# EAGLE design Solenoid_Board (EAGLE 6.2)
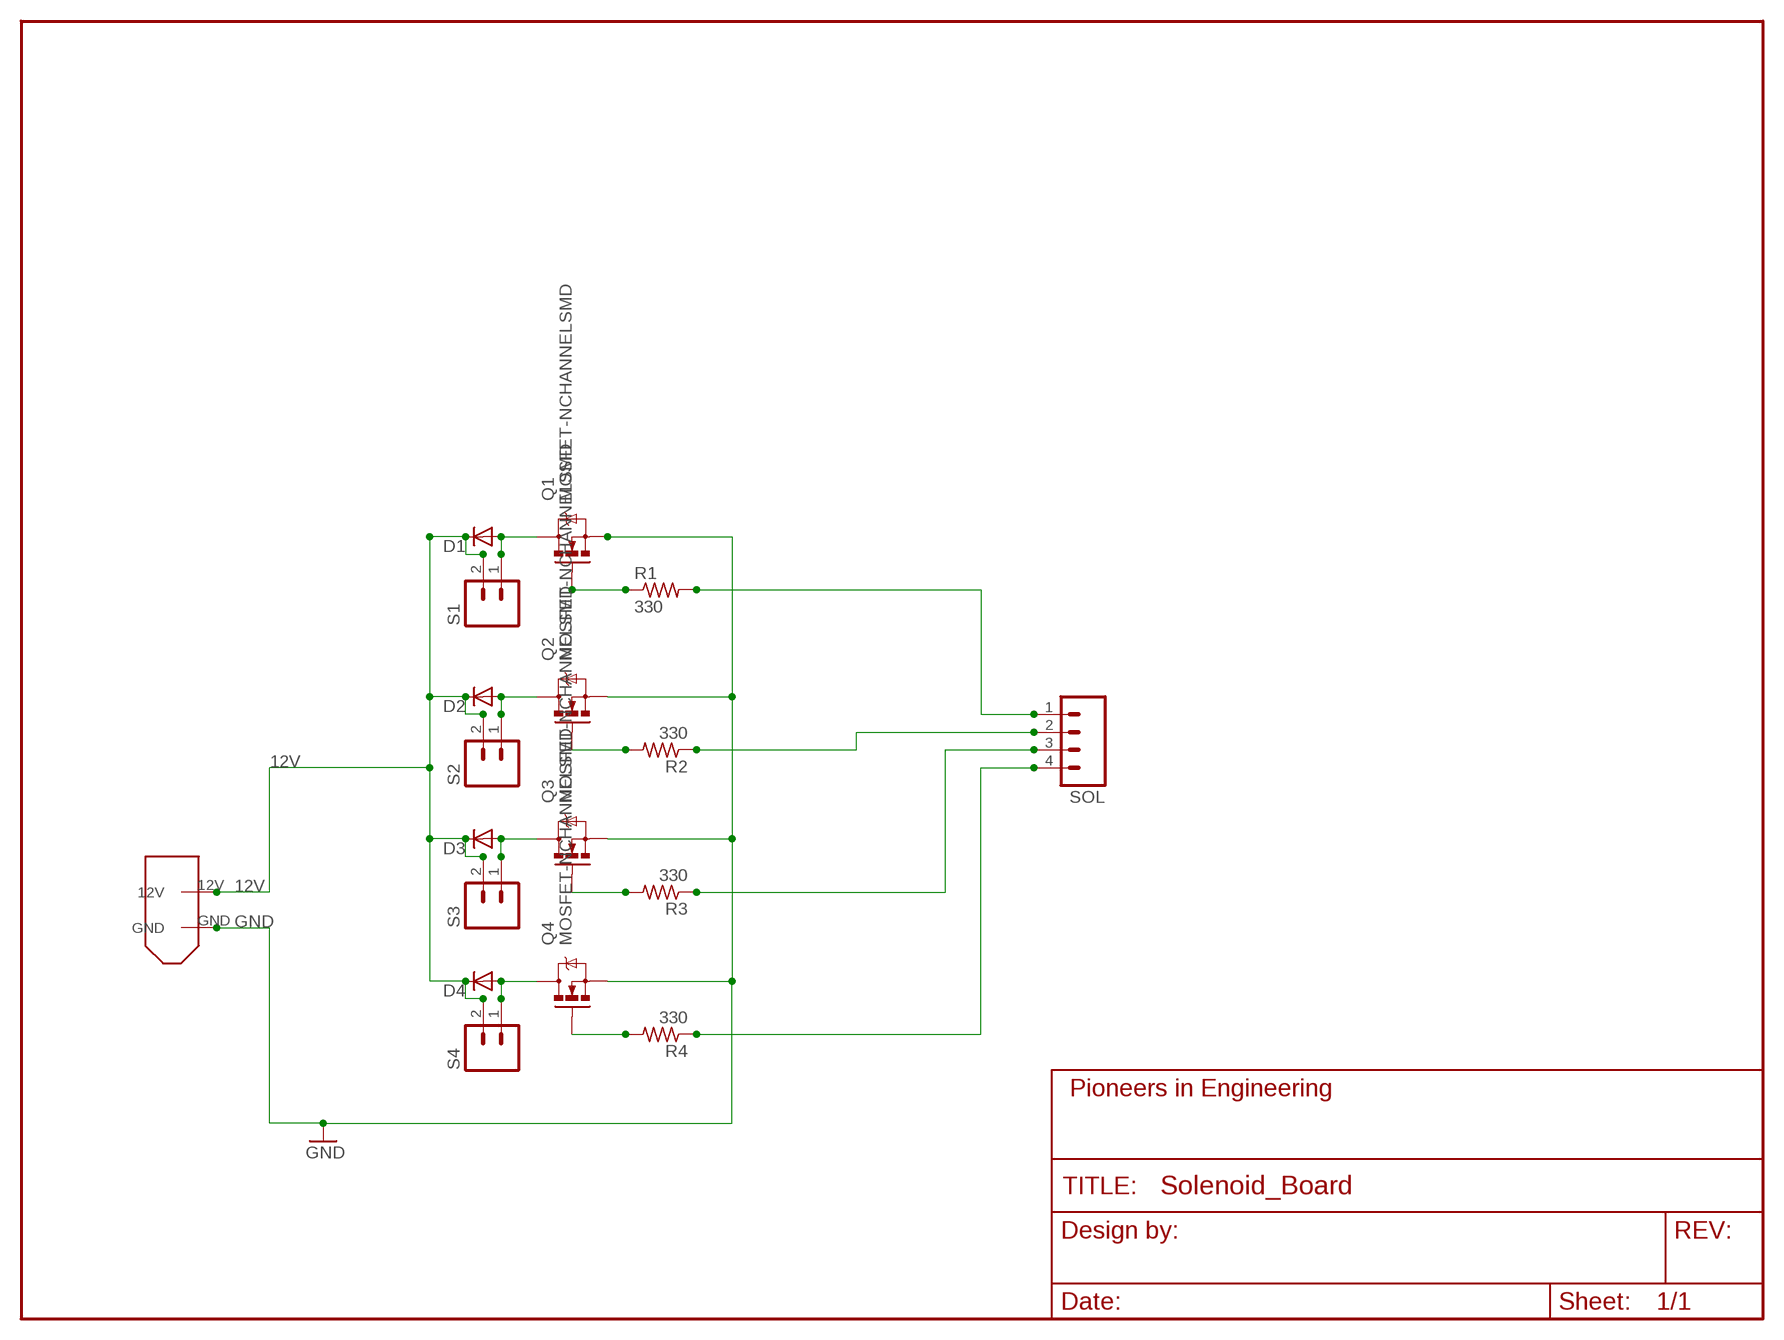
[diagram p0: schematic, sheet 1]
FRAME1 (FRAME-LETTER): AUTHOR: Sumita Ghosh; REVISION: B

## Parts
D1  DIODESMA-ALT  [SMA-DIODE_ALT]
D2  DIODESMA-ALT  [SMA-DIODE_ALT]
D3  DIODESMA-ALT  [SMA-DIODE_ALT]
D4  DIODESMA-ALT  [SMA-DIODE_ALT]
Q1  MOSFET-NCHANNELSMD  [SOT23-3]
Q2  MOSFET-NCHANNELSMD  [SOT23-3]
Q3  MOSFET-NCHANNELSMD  [SOT23-3]
Q4  MOSFET-NCHANNELSMD  [SOT23-3]
R1  330  R-US_R0603  [R0603]
R2  330  R-US_R0603  [R0603]
R3  330  R-US_R0603  [R0603]
R4  330  R-US_R0603  [R0603]
S1  M02  [1X02]
S2  M02  [1X02]
S3  M02  [1X02]
S4  M02  [1X02]
SOL  M04  [1X04]
U$2  XT60CONNECTOR  [XT60CONNECTOR]

## Nets
12V [power]: D1.C D2.C D3.C D4.C S1.2 S2.2 S3.2 S4.2 U$2.12V
GND: Q1.2(S) Q2.2(S) Q3.2(S) Q4.2(S) U$2.GND
N$1: R1.2 SOL.1
N$2: D1.A Q1.3(D) S1.1
N$3 [power]: D4.A Q4.3(D) S4.1
N$4 [power]: D3.A Q3.3(D) S3.1
N$5: R2.1 SOL.2
N$6: R3.1 SOL.3
N$7: R4.1 SOL.4
N$8 [power]: D2.A Q2.3(D) S2.1
N$15: Q1.1(G) R1.1
N$16: Q2.1(G) R2.2
N$17: Q3.1(G) R3.2
N$18: Q4.1(G) R4.2

## Library data of the parts
D1-D4 = SparkFun:DIODE: Diode These are standard reverse protection diodes and small signal diodes. SMA package can handle up to about 1A. SOD-323 can handle about 200mA. What the SOD-323 package when ordering, there are some mfgs out there that are 5-pin packages.
Q1-Q4 = SparkFun:MOSFET-NCHANNEL
R1-R4 = resistor:R-US_: RESISTOR, American symbol
S1-S4 = pie:M02
SOL = pie:M04
U$2 = pie:XT60CONNECTOR: 12V XT60 power connector

## Net classes
1 power: width 0.406 mm, drill 0.381 mm, clearance 0.203 mm

## Board
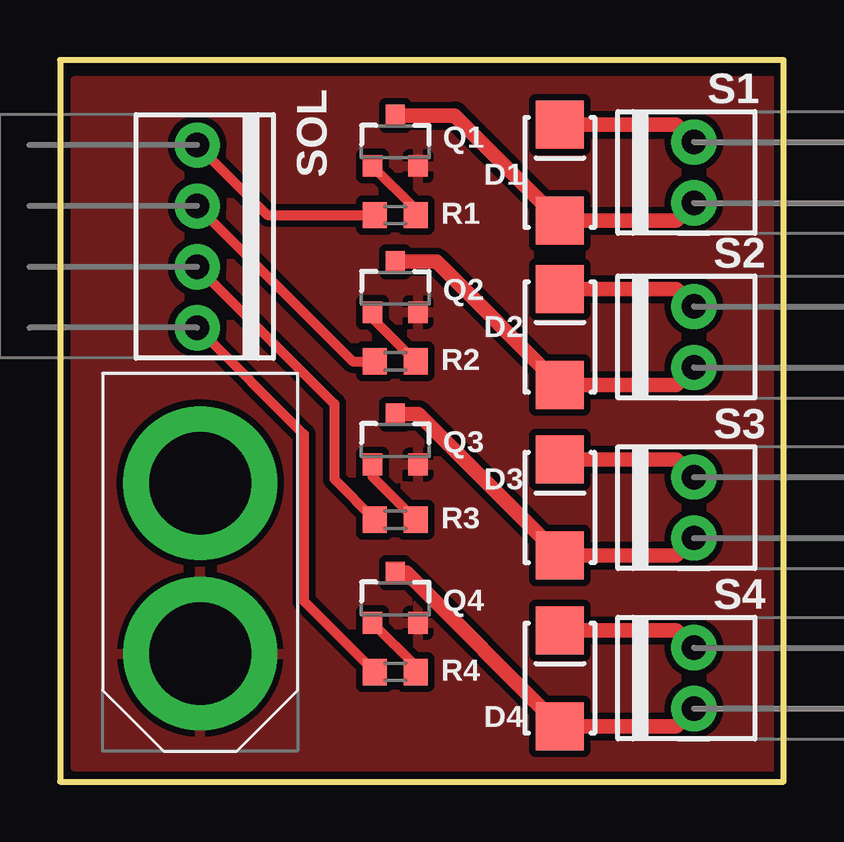
[diagram p1: board, top side]
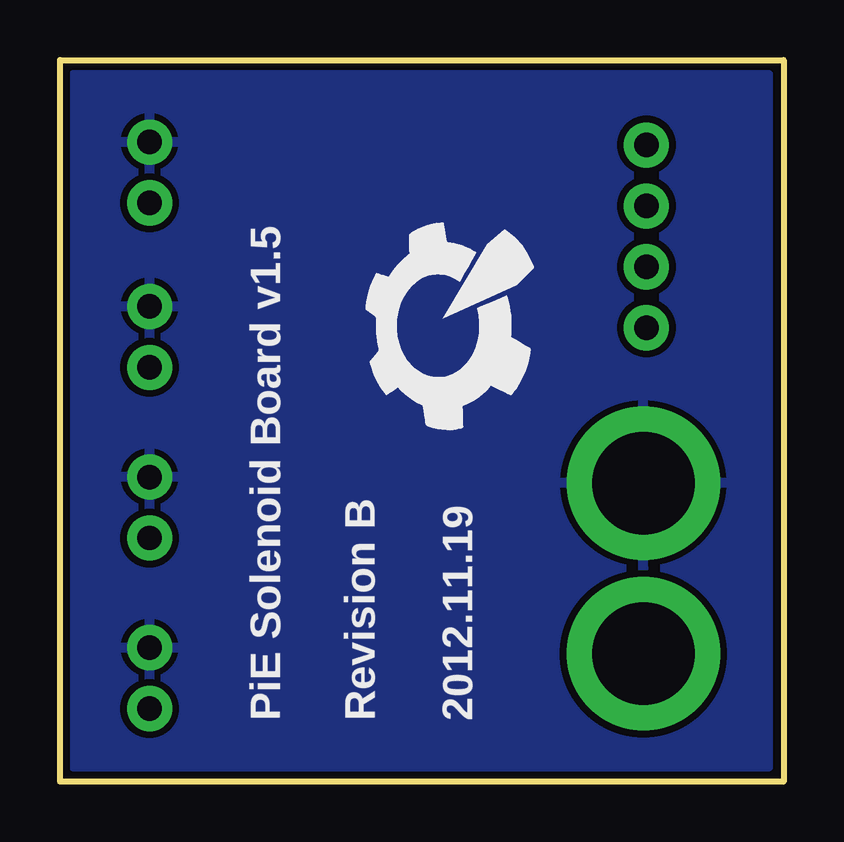
[diagram p2: board, bottom side, seen from below]

Size 30.15 x 30.09 mm. Coordinates in mm from the lower left corner, seen from the top.
Outline: 0,0 30.15,0 30.15,30.09 0,30.09 0,0
Copper layers (1*16): Top 2mil / dielectric 9mil / Bottom 2mil
Design rules: minimum track width 6mil, minimum drill 15mil, track to track 6mil, track to pad 6mil, pad to pad 6mil, via to via 6mil, smd to smd 6mil, copper to edge 10mil, drill to drill 7mil, minimum pad ring 7mil, minimum via ring 7mil, stop-mask expansion 3mil, vias tented up to drill 0mil, thermal gap 10mil

### Footprints (pad centres in the part's own frame; a part is rotated, then mirrored left to right if it is on the bottom)
SMA-DIODE_ALT = smd 2 x 2: A -2,0; C 2,0
SOT23-3 = smd 0.8 x 0.9: 1 -0.95,-1; 2 0.95,-1; 3 0,1.1
R0603 = smd 1 x 1.1: 1 -0.85,0; 2 0.85,0
1X02 = drill 1.016 pad 1.88: 1 0,0; 2 2.54,0
1X04 = drill 1.016 pad 1.88: 1 -3.81,0; 2 -1.27,0; 3 1.27,0; 4 3.81,0
XT60CONNECTOR = drill 4.267: 12V 4.572,4.064; GND 11.684,4.064

### Placement (x,y rotation side)
D1  20.83,25.4 90 top
D2  20.83,18.54 90 top
D3  20.83,11.43 90 top
D4  20.83,4.32 90 top
Q1  13.97,26.67 0 top
Q2  13.97,20.57 0 top
Q3  13.97,14.22 0 top
Q4  13.97,7.62 0 top
R1  13.97,23.62 180 top
R2  13.97,17.53 0 top
R3  13.97,10.92 0 top
R4  13.97,4.57 0 top
S1  26.42,24.13 90 top
S2  26.42,17.27 90 top
S3  26.42,10.16 90 top
S4  26.42,3.05 90 top
SOL  5.71,22.73 270 top
U$1  [PIE-LOGO-SMALL]  14.22,19.3 90 bottom
U$2  1.78,17.02 270 top

### Tracks (layer width: path | path; a pad name or v marks a point on that pad's centre or on a via)
12V
  Top 0.61: D1.C 25.69,27.4 S1.2 | D2.C 25.69,20.54 S2.2 | D3.C 25.69,13.43 S3.2 | D4.C 25.69,6.32 S4.2
  pour Bottom (isolate 0.279): 0.64,29.46 29.59,29.46 29.59,0.64 0.64,0.64
GND
  Top 0.406: 14.97,25.67 Q1.2
  pour Top (isolate 0.279): 0.64,29.21 0.64,0.64 29.72,0.64 29.72,29.21
N$1
  Top 0.406: 13.12,23.53 R1.2 8.64,23.62 SOL.1
N$2
  Top 0.61: S1.1 25.69,23.4 D1.A 16.46,27.77 Q1.3
N$3
  Top 0.61: S4.1 25.69,2.32 D4.A 14.43,8.72 Q4.3
N$4
  Top 0.61: S3.1 25.69,9.43 D3.A 14.93,15.32 Q3.3
N$5
  Top 0.406: SOL.2 12.19,17.53 R2.1
N$6
  Top 0.406: R3.1 11.43,12.61 11.43,15.75 SOL.3
N$7
  Top 0.406: R4.1 10.16,7.53 10.16,13.72 10.16,14.48 SOL.4
N$8
  Top 0.61: S2.1 25.69,16.54 D2.A 15.7,21.67 Q2.3
N$15
  Top 0.406: Q1.1 14.82,23.87 R1.1
N$16
  Top 0.406: Q2.1 13.02,19.33 R2.2
N$17
  Top 0.406: Q3.1 13.02,12.72 R3.2
N$18
  Top 0.406: Q4.1 14.82,4.82 R4.2

### Text on the board
bPlace: 2012.11.19 | Revision B
bNames: PiE Solenoid Board v1.5